# Altium schematic sheet term.SchDoc
size A3
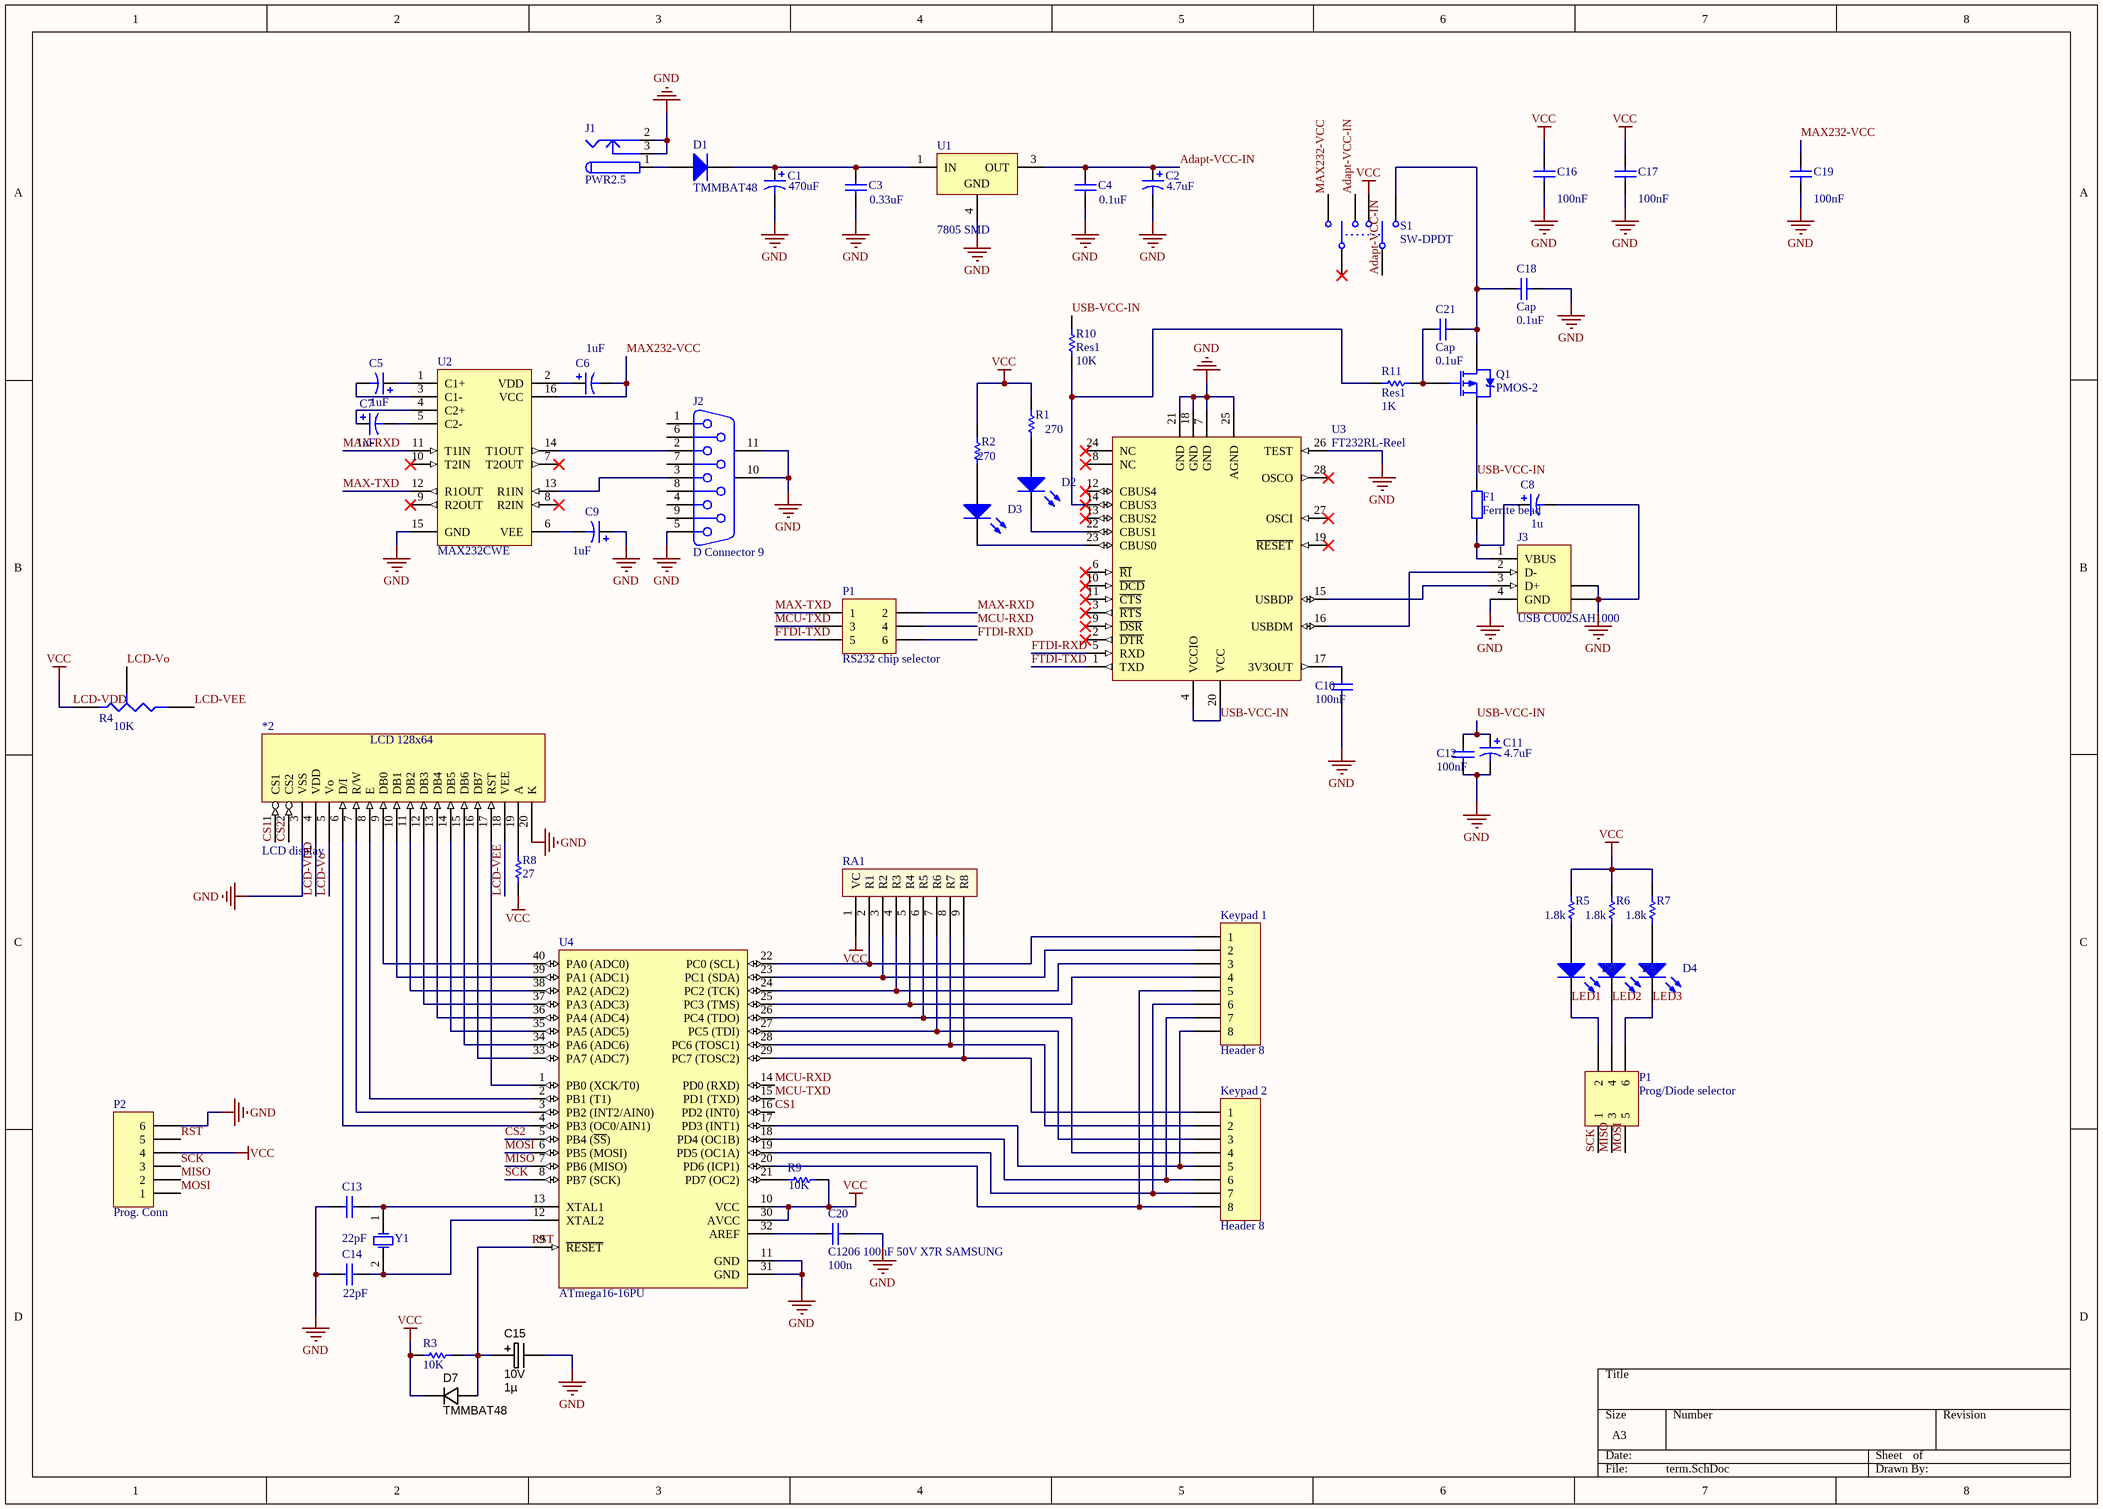
[diagram p0: term.SchDoc]

## Parts
(Parts that share a designator on the sheet are numbered #1, #2 ... from top to bottom, then left to right.)
*2  LCD display  [LCD 128x64]
C1  value 470uF  [Cap 8x12mm]  (hidden comment: CE 470uF 25V Fujicon)
C2  value 4.7uF  [Cap. el. 5x11mm]  (hidden comment: CE 4.7uF 50V Fujicon)
C3  value 0.33uF  [Cap ceramic 4.2x3.8mm]  (hidden comment: CML 330nF 50V P5)
C4  value 0.1uF  [Cap. ceramic 4.2x3.8mm]  (hidden comment: CML 100nF 50V Y5V P2.5)
C5  value 1uF  [Cap. el. 5x11mm]  (hidden comment: CE 1.0uF 50V Fujicon)
C6  value 1uF  [Cap. el. 5x11mm]  (hidden comment: CE 1.0uF 50V Fujicon)
C7  value 1uF  [Cap. el. 5x11mm]  (hidden comment: CE 1.0uF 50V Fujicon)
C8  value 1u  [Cap. el. 5x11mm]  (hidden comment: CE 1.0uF 50V Fujicon)
C9  value 1uF  [Cap. el. 5x11mm]  (hidden comment: CE 1.0uF 50V Fujicon)
C10  value 100nF  [C0805]  (hidden comment: C0805 100nF 50V Y5V SAMSUNG)
C11  value 4.7uF  [Cap. el. 5x11mm]  (hidden comment: CE 4.7uF 50V Fujicon)
C12  value 100nF  [C0805]  (hidden comment: C0805 100nF 50V Y5V SAMSUNG)
C13  value 22pF  [Cap. ceramic 4.2x3.8mm]  (hidden comment: CML 22pF 50V NP0)
C14  value 22pF  [Cap. ceramic 4.2x3.8mm]  (hidden comment: CML 22pF 50V NP0)
C15  value 1µ  Ratings: 10V  [Cap. el. 5x11mm]  (hidden comment: CE 1.0uF 50V Fujicon)
C16  value 100nF  [C1206]  (hidden comment: C1206 100nF 50V X7R SAMSUNG)
C17  value 100nF  [C1206]  (hidden comment: C1206 100nF 50V X7R SAMSUNG)
C18  Cap  value 0.1uF  [Cap. ceramic 4.2x3.8mm]
C19  value 100nF  [C1206]  (hidden comment: C1206 100nF 50V X7R SAMSUNG)
C20  C1206 100nF 50V X7R SAMSUNG  value 100n  [C1206]
C21  Cap  value 0.1uF  [Cap. ceramic 4.2x3.8mm]
D1  TMMBAT48  [SOD-80]
D2  L-934LYD  [LED 3mm]  (value not drawn)
D3  L-934LYD  [LED 3mm]  (value not drawn)
D4  HLMP-Q150-F0032  [LED 3mm]  (value not drawn)
D5  HLMP-Q150-F0032  [LED 3mm]  (value not drawn)
D6  HLMP-Q150-F0032  [LED 3mm]  (value not drawn)
D7  TMMBAT48  [SOD-80 A-K]
F1  Ferrite bead  [RES0603R]
J1  PWR2.5  [DC- Power connector]
J2  D Connector 9  [DSUB1.385-2H9]
J3  USB CU02SAH1000  [787780]
Keypad_1  Header 8  [HDR1X8]
Keypad_2  Header 8  [HDR1X8]
P1#1  RS232 chip selector  [HDR2X3]
P1#2  Prog/Diode selector  [HDR2X3]
P2  Prog. Conn  [HDR1X6]
Q1  PMOS-2  [TO-92A]
R1  value 270  [RES1206R]  (hidden comment: RES SMD 1206 5% 200ppm 270R 1/4W)
R2  value 270  [RES1206R]  (hidden comment: RES SMD 1206 5% 200ppm 270R 1/4W)
R3  value 10K  [AXIAL-0.3]  (hidden comment: RW125CF 10K)
R4  value 10K  [Trimmer]  (hidden comment: PT6v(655MCL)10K)
R5  value 1.8k  [RES1206R]  (hidden comment: R1206 1.8K 5% VISHAY)
R6  value 1.8k  [RES1206R]  (hidden comment: R1206 1.8K 5% VISHAY)
R7  value 1.8k  [RES1206R]  (hidden comment: R1206 1.8K 5% VISHAY)
R8  value 27  [AXIAL-0.3]  (hidden comment: R1206 27R 5% YAG/ASJ)
R9  value 10K  [AXIAL-0.3]  (hidden comment: RW125CF 10K)
R10  Res1  value 10K  [AXIAL-0.3]
R11  Res1  value 1K  [RES1206R]
RA1  RA8A9 10K  [RA8A9]  (value not drawn)
S1  SW-DPDT  [SWITCH-DPDT - dpl]
U1  7805 SMD  [D2PAK-3]
U2  MAX232CWE  [NSO16_L]
U3  FT232RL-Reel  [SSOP-28_N]
U4  ATmega16-16PU  [40P6]
Y1  Q11.0592 MHz HC-49S  [XTAL]  (value not drawn)

## Nets
GND: *2.3(VSS) *2.20(K) C1.2 C2.2 C3.1 C4.1 C8.2 C9.1 C10.2 C11.2 C12.2 C13.1 C14.1 C15.2 C16.1 C17.1 C18.2 C19.1 C20.2 J1.2 J1.3 J2.5 J2.10(MH1) J2.11(MH2) J3.4(GND) J3.5(SHLD) J3.6(SHLD) P2.6 U1.4(GND) U2.15(GND) U3.7(GND) U3.18(GND) U3.21(GND) U3.25(AGND) U3.26(TEST) U4.11(GND) U4.31(GND)
LCD-VDD: *2.4(VDD) C16.2 C17.2 D7.K P2.4 R1.2 R2.2 R3.1 R4.1(A) R5.2 R6.2 R7.2 R8.1 R9.2 RA1.1(VC) S1.5 U4.10(VCC) U4.30(AVCC)  [also labelled VCC]
Adapt-VCC-IN: C2.1 C4.2 S1.3 S1.4 U1.3(OUT)
CS1: *2.1(CS1) U4.16(PD2_(INT0))
CS2: *2.2(CS2) U4.5(PB4_(~{SS}))
FTDI-RXD: P1#1.6 U3.5(RXD)
FTDI-TXD: P1#1.5 U3.1(TXD)
LCD-VEE: *2.18(VEE) R4.2(B)
LCD-Vo: *2.5(Vo) R4.3(TAP)
LED1: D6.2(K) P1#2.2
LED2: D5.2(K) P1#2.4
LED3: D4.2(K) P1#2.6
MAX232-VCC: C6.2 C19.2 S1.2 U2.16(VCC)
MAX-RXD: P1#1.2 U2.11(T1IN)
MAX-TXD: P1#1.1 U2.12(R1OUT)
MCU-RXD: P1#1.4 U4.14(PD0_(RXD))
MCU-TXD: P1#1.3 U4.15(PD1_(TXD))
MISO: P1#2.3 P2.2 U4.7(PB6_(MISO))
MOSI: P1#2.5 P2.1 U4.6(PB5_(MOSI))
RST: C15.1 D7.A P2.5 R3.2 U4.9(~{RESET})
SCK: P1#2.1 P2.3 U4.8(PB7_(SCK))
USB-VCC-IN: C11.1 C12.1 F1.1 Q1.3(S) R10.1 U3.4(VCCIO) U3.20(VCC)
Net*2_6: *2.6(D/I) U4.4(PB3_(OC0/AIN1))
Net*2_7: *2.7(R/W) U4.3(PB2_(INT2/AIN0))
Net*2_8: *2.8(E) U4.2(PB1_(T1))
Net*2_9: *2.9(DB0) U4.40(PA0_(ADC0))
Net*2_10: *2.10(DB1) U4.39(PA1_(ADC1))
Net*2_11: *2.11(DB2) U4.38(PA2_(ADC2))
Net*2_12: *2.12(DB3) U4.37(PA3_(ADC3))
Net*2_13: *2.13(DB4) U4.36(PA4_(ADC4))
Net*2_14: *2.14(DB5) U4.35(PA5_(ADC5))
Net*2_15: *2.15(DB6) U4.34(PA6_(ADC6))
Net*2_16: *2.16(DB7) U4.33(PA7_(ADC7))
Net*2_17: *2.17(RST) U4.1(PB0_(XCK/T0))
Net*2_19: *2.19(A) R8.2
NetC1_1: C1.1 C3.2 D1.2(K) U1.1(IN)
NetC5_1: C5.1 U2.1(C1+)
NetC5_2: C5.2 U2.3(C1-)
NetC6_1: C6.1 U2.2(VDD)
NetC7_1: C7.1 U2.4(C2+)
NetC7_2: C7.2 U2.5(C2-)
NetC8_1: C8.1 F1.2 J3.1(VBUS)
NetC9_2: C9.2 U2.6(VEE)
NetC10_1: C10.1 U3.17(3V3OUT)
NetC13_2: C13.2 U4.13(XTAL1) Y1.1(OSC1)
NetC14_2: C14.2 U4.12(XTAL2) Y1.2(OSC2)
NetC18_1: C18.1 C21.2 Q1.1(D) S1.6
NetC20_1: C20.1 U4.32(AREF)
NetC21_1: C21.1 Q1.2(G) R11.2
NetD1_1: D1.1(A) J1.1
NetD2_1: D2.1(A) R1.1
NetD2_2: D2.2(K) U3.22(CBUS1)
NetD3_1: D3.1(A) R2.1
NetD3_2: D3.2(K) U3.23(CBUS0)
NetD4_1: D4.1(A) R7.1
NetD5_1: D5.1(A) R6.1
NetD6_1: D6.1(A) R5.1
NetJ2_2: J2.2 U2.14(T1OUT)
NetJ2_3: J2.3 U2.13(R1IN)
NetJ3_2: J3.2(D-) U3.16(USBDM)
NetJ3_3: J3.3(D+) U3.15(USBDP)
NetKeypad_1_1: Keypad_1.1 RA1.2(R1) U4.22(PC0_(SCL))
NetKeypad_1_2: Keypad_1.2 RA1.3(R2) U4.23(PC1_(SDA))
NetKeypad_1_3: Keypad_1.3 RA1.4(R3) U4.24(PC2_(TCK))
NetKeypad_1_4: Keypad_1.4 RA1.5(R4) U4.25(PC3_(TMS))
NetKeypad_1_5: Keypad_1.5 Keypad_2.8 U4.20(PD6_(ICP1))
NetKeypad_1_6: Keypad_1.6 Keypad_2.7 U4.19(PD5_(OC1A))
NetKeypad_1_7: Keypad_1.7 Keypad_2.6 U4.18(PD4_(OC1B))
NetKeypad_1_8: Keypad_1.8 Keypad_2.5 U4.17(PD3_(INT1))
NetKeypad_2_1: Keypad_2.1 RA1.9(R8) U4.29(PC7_(TOSC2))
NetKeypad_2_2: Keypad_2.2 RA1.8(R7) U4.28(PC6_(TOSC1))
NetKeypad_2_3: Keypad_2.3 RA1.7(R6) U4.27(PC5_(TDI))
NetKeypad_2_4: Keypad_2.4 RA1.6(R5) U4.26(PC4_(TDO))
NetR9_1: R9.1 U4.21(PD7_(OC2))
NetR10_2: R10.2 R11.1 U3.14(CBUS3)

Not connected (* = marked no-connect by the designer): J2 1 4 6 7 8 9; S1 1*; U2 7(T2OUT)* 8(R2IN)* 9(R2OUT)* 10(T2IN)*; U3 2(~{DTR})* 3(~{RTS})* 6(~{RI})* 8(NC)* 9(~{DSR})* 10(~{DCD})* 11(~{CTS})* 12(CBUS4)* 13(CBUS2)* 19(~{RESET})* 24(NC)* 27(OSCI)* 28(OSCO)*

## Notes on the sheet
- (in symbol LCD display) LCD 128x64

## Library data of the parts
C1 = Cap Pol1: Published: 8-Jun-2000; LatestRevisionDate: 17-Jul-2002; LatestRevisionNote: Re-released for DXP Platform.; PackageReference: RB7.6-15; Publisher: Altium Limited; PackageDescription: Polarized Capacitor (Radial); 2 Leads
C2 C5-C9 C11 = Cap Pol1: Polarized Capacitor (Radial); Published: 8-Jun-2000; LatestRevisionDate: 17-Jul-2002; LatestRevisionNote: Re-released for DXP Platform.; PackageReference: RB7.6-15; Publisher: Altium Limited; PackageDescription: Polarized Capacitor (Radial); 2 Leads
C3 C4 C13 C14 C16-C21 = Cap: Capacitor; Published: 8-Jun-2000; LatestRevisionDate: 17-Jul-2002; LatestRevisionNote: Re-released for DXP Platform.; PackageReference: RAD-0.3; Publisher: Altium Limited; PackageDescription: Radial Cap, Thru-Hole; 2 Leads; 0.3 in Pin Spacing
C10 C12 = Cap Semi: Capacitor (Semiconductor SIM Model); Published: 8-Jun-2000; LatestRevisionDate: 29-May-2009; LatestRevisionNote: IPC-7351 Footprint Added.; PackageReference: C1206; Publisher: Altium Limited; PackageDescription: Chip Capacitor
C15 = CAPT_1u_0805_10V: Capacitor SMD Tantalum 1uF 20% 10V 0805; Manufacturer 1: AVX Corporation; Manufacturer Part Number 1: TAJP106M010RNJ; Manufacturer Size Code: P; ESR (Equivalent Series Resistance): 6.000 Ohm; Type: Molded; SCDType: spec; Package / Case: 0805 (2012 metric); Tolerance: ±20%; Material: Tantalum; Supplier 1: Digi-Key; Supplier Part Number 1: 478-3281-1-ND; Operating Temperature: -55°C ~ 125°C; Size / Dimension: 0.081" L x 0.053" W (2.05mm x 1.35mm); Height - Seated (Max): 0.059" (1.50mm); ComponentLink1URL: http://www.avx.com/docs/Catalogs/tajlp.pdf; ComponentLink1Description: http://www.avx.com/docs/Catalogs/tajlp.pdf
D1 = Diode 1N5407: 3 Amp Medium Power Silicon Rectifier Diode; Published: 8-Jun-2000; LatestRevisionDate: 17-Jul-2002; LatestRevisionNote: Re-released for DXP Platform.; DatasheetVersion: Aug-1984; PackageReference: DO-201AD; Publisher: Altium Limited; PackageDescription: Diode, Axial; Body 9.5 x 5.3 mm (LxDia. max), Lead Dia. 1.32 mm (max); ComponentLink1Description: Manufacturer Link; ComponentLink1URL: http://www.irf.com/
D2 D3 = HLMA-PF00-N0031: Subminiature High Performance AlInGaP Red LED Lamp; LuminousIntensity: 25mcd (Minimum).; PCB_Layout: Complies with manufacturer's recommendation.; DrillSize: Nominal, Rounded to nearest 0.05mm; Published: 11-Dec-2002; DatasheetVersion: 24-Oct-2001; PackageVersion: Apr-2001; PackageReference: 2.2X2.1X2.2Z; Publisher: Altium Limited; PackageDescription: SM LED; 2 Z-Bend Leads; LED_Colour: Red; ComponentLink1Description: Manufacturer Link; ComponentLink1URL: http://www.avagotech.com/; ComponentLink2Description: Datasheet; ComponentLink2URL: http://cp.literature.agilent.com/litweb/pdf/5988-4548EN.pdf
D4-D6 = HLMP-Q150-F0032: Subminiature Red LED Lamp; LuminousIntensity: 1mcd (Minimum).; PCB_Layout: Complies with manufacturer's recommendation.; DrillSize: Nominal, Rounded to nearest 0.05mm; Published: 11-Dec-2002; DatasheetVersion: 30-Apr-2002; PackageVersion: Apr-2001; PackageReference: 2.2X2.1X2.9Z; Publisher: Altium Limited; PackageDescription: SM LED; 2 Z-Bend Leads; LED_Colour: Red; ComponentLink1Description: Manufacturer Link; ComponentLink1URL: http://www.avagotech.com/; ComponentLink2Description: Datasheet; ComponentLink2URL: http://cp.literature.agilent.com/litweb/pdf/5988-6260EN.pdf
D7 = DIODE_1N4148_200mA_SOD523F: Diode SMD small signal 0.2A SOD-523F; Manufacturer 1: Fairchild Semiconductor; Manufacturer Part Number 1: 1N4148WT; Ratings: Vr=75V; Vf=1V@10mA; Io=200mA; Material: Si; SCDType: source; Package / Case: SC-79, SOD-523F; Supplier 1: Digi-Key; Supplier Part Number 1: 1N4148WTCT-ND; ComponentLink1URL: http://www.fairchildsemi.com/ds/1N/1N914BWT.pdf; ComponentLink1Description: http://www.fairchildsemi.com/ds/1N/1N914BWT.pdf; Value: TMMBAT48
F1 = Res2: Resistor; Value: 1K; Published: 8-Jun-2000; LatestRevisionDate: 17-Jul-2002; LatestRevisionNote: Re-released for DXP Platform.; PackageReference: AXIAL-0.4; Publisher: Altium Limited; PackageDescription: Axial Device, Thru-Hole; 2 Leads; 0.4 in Pin Spacing
J1 = PWR2.5: Low Voltage Power Supply Connector; Published: 17-Dec-2003; DatasheetDocument: 09-May-2002; Publisher: Altium Limited; ComponentLink1Description: Manufacturer Link; ComponentLink1URL: http://domino.kycon.com/internet/Products.html
J2 = D Connector 9: Receptacle Assembly, 9 Position, Right Angle; PackageDocument: O; Positions: 9; Published: 15-Jun-2001; LatestRevisionDate: 17-Jul-2002; LatestRevisionNote: Re-released for DXP Platform.; DatasheetDocument: 1-Sep-1999; PackageReference: 788750; Publisher: Altium Limited; Orientation: Right Angle; Gender: Receptacle
J3 = 787834-2: USB 1.1, Vertical, Thru-Hole, B Type, Receptacle, 4 Position, Natural; ContactMaterial: Copper Alloy; ContactPlating: Gold Flash over Palladium Nickel or Gold (30) over Nickel; TerminationLength: 3.02mm [0.119in.]; PCB_Layout: Complies with manufacturer's recommendation.; DrillSize: Corresponds to nominal value.; PanelGround: Without; Published: 15-Jul-2004; DatasheetDocument: 11-Jan-2004; PackageDocument: 11-Jan-2004; PackageReference: 787834; Publisher: Altium Limited; HousingMaterial: Thermoplastic; ComponentLink1Description: Manufacturer Link; ComponentLink1URL: http://www.tycoelectronics.com/; ComponentLink2Description: Packaging Specification; ComponentLink2URL: http://ecommas.tycoelectronics.com/commerce/DocumentDelivery/DDEController?Action=showdoc&DocId=Customer+Drawing%7F787834%7FG%7Ftif%7FEnglish%7FC_787834_G.tif
Keypad_1 Keypad_2 = Header 8: Header, 8-Pin; LatestRevisionDate: 17-Jul-2002; LatestRevisionNote: Re-released for DXP Platform.; Publisher: Altium Limited
P1#1 P1#2 = Header 3X2: Header, 3-Pin, Dual row; LatestRevisionDate: 17-Jul-2002; LatestRevisionNote: Re-released for DXP Platform.; Publisher: Altium Limited
P2 = Header 6: Header, 6-Pin; LatestRevisionDate: 17-Jul-2002; LatestRevisionNote: Re-released for DXP Platform.; Publisher: Altium Limited
Q1 = PMOS-2: P-Channel Power MOSFET; Note: Pin 4 not drawn and electrically connected to Pin 2.; Published: 8-Jun-2000; LatestRevisionDate: 17-Jul-2002; LatestRevisionNote: Re-released for DXP Platform.; DatasheetVersion: PD-9.390D; PackageVersion: Feb-1997; PackageReference: TO-220AB; Publisher: Altium Limited; PackageDescription: TO, Thru-Hole, Vertical, Heatsink Mounted; 3 In-Line Leads; Pitch 2.54 mm; ComponentLink1Description: Manufacturer Link; ComponentLink1URL: http://www.irf.com/
R1-R3 R5-R11 = Res1: Resistor; Published: 8-Jun-2000; LatestRevisionDate: 17-Jul-2002; LatestRevisionNote: Re-released for DXP Platform.; PackageReference: AXIAL-0.3; Publisher: Altium Limited; PackageDescription: Axial Device, Thru-Hole; 2 Leads; 0.3 in Pin Spacing
R4 = Res Tap: Tapped Resistor; Sim Note: Enter the Resistance value and the set point into parameter fields.; Set Position: 0.5; Published: 24-Mar-1999; LatestRevisionDate: 17-Jul-2002; LatestRevisionNote: Re-released for DXP Platform.; PackageReference: VR3; Publisher: Altium Limited; PackageDescription: Variable Resistor, Thru-Hole; 3 Leads
RA1 = Component_1
S1 = SW-DPDT: Double-Pole, Double-Throw Switch; Published: 24-Mar-1999; LatestRevisionDate: 17-Jul-2002; LatestRevisionNote: Re-released for DXP Platform.; PackageReference: DPDT-6; Publisher: Altium Limited; PackageDescription: Switch; 6 Leads
U1 = LM2931AD2T-5.0: Low Dropout Voltage Regulator; Note: Pin 4 is electrically connected to Pin 2;Pin 4 is heatsink; Published: 15-Apr-2002; DatasheetVersion: 1997; PackageVersion: 1997; PackageReference: 936-03; Publisher: Altium Limited; PackageDescription: D2-PAK/TO-263-AB; 3 Leads (1 Cropped); Body 14.7 (inc. leads) x 10.2 mm (LxW max); ComponentLink1Description: Manufacturer Link; ComponentLink1URL: http://www.onsemi.com/site/products/taxonomy/0,4438,503,00.html; ComponentLink2Description: Datasheet; ComponentLink2URL: http://www.onsemi.com/pub/Collateral/LM2931-D.PDF
U2 = MAX232CWE: +5V Powered RS-232 Driver/Receiver; Published: 16-Jan-2001; LatestRevisionDate: 13-Apr-2006; LatestRevisionNote: IPC-7351 Footprint Added.; DatasheetVersion: Apr-1992; PackageReference: WSO16; Publisher: Altium Limited; PackageDescription: 16-Pin Small Outline Integrated Circuit 1.27 mm Pitch; Code_JEDEC: MS-013-AA; Code_IPC: SOIC127P1030-16; ComponentLink1Description: Manufacturer Link; ComponentLink1URL: http://www.maxim-ic.com/; ComponentLink2Description: Datasheet; ComponentLink2URL: http://pdfserv.maxim-ic.com/en/ds/MAX220-MAX249.pdf
U3 = FT232RL-Reel: USB UART Asynchronous Serial Data Transfer Chip, SSOP-28, Tape and Reel; Published: 19-Aug-2010; DatasheetVersion: ver 2.07, Jul-2010; PackageVersion: 2010; PackageReference: SSOP-28; Publisher: Altium Limited; PackageDescription: 28-Pin Small Outline Package 0.65 mm Pitch; ComponentLink1Description: Manufacturer Link; ComponentLink1URL: http://www.ftdichip.com/Products/ICs/FT232R.htm; ComponentLink2Description: Datasheet; ComponentLink2URL: http://www.ftdichip.com/Support/Documents/DataSheets/ICs/DS_FT232R.pdf
U4 = ATmega16-16PU: 8-bit AVR Microcontroller, 4.5-5.5V, 16KB Flash, 512 Bytes EEPROM, 1KB SRAM, 40-pin PDIP, Industrial Grade (-40°C to 85°C); Published: 1-Apr-2010; DatasheetVersion: revS, May-2009; PackageVersion: revB, Sep-2001; PackageReference: 40P6; Publisher: Altium Limited; PackageDescription: 40-lead (0.600"/15.24mm Wide) Plastic Dual Inline Package (PDIP); Supplier 1: Digi-Key; Supplier Part Number 1: ATMEGA16-16PU-ND; Supplier 2: Farnell; Supplier Part Number 2: 9171142; Supplier 3: Farnell; Supplier Part Number 3: 1523819; Supplier 4: Mouser; Supplier Part Number 4: 556-ATMEGA16-16PU; Code_JEDEC: MS-011-AC; ComponentLink1Description: Manufacturer Link; ComponentLink1URL: http://www.atmel.com/products/avr/default.asp?; ComponentLink2Description: ATmega16(L)  Datasheet; ComponentLink2URL: http://www.atmel.com/dyn/resources/prod_documents/doc2466.pdf; ComponentLink3Description: ATmega16(L) Summary; ComponentLink3URL: http://www.atmel.com/dyn/resources/prod_documents/2466S.pdf; ComponentLink4Description: Atmel.com Home; ComponentLink4URL: http://www.atmel.com
Y1 = XTAL: Crystal Oscillator; Published: 8-Jun-2000; LatestRevisionDate: 17-Jul-2002; LatestRevisionNote: Re-released for DXP Platform.; PackageReference: R38; Publisher: Altium Limited; PackageDescription: Crystal, Thru-Hole; 2 Leads; Body 3.1 x 8.2 mm (Dia.xH)